# EAGLE schematic v1 (EAGLE 9.6.2)
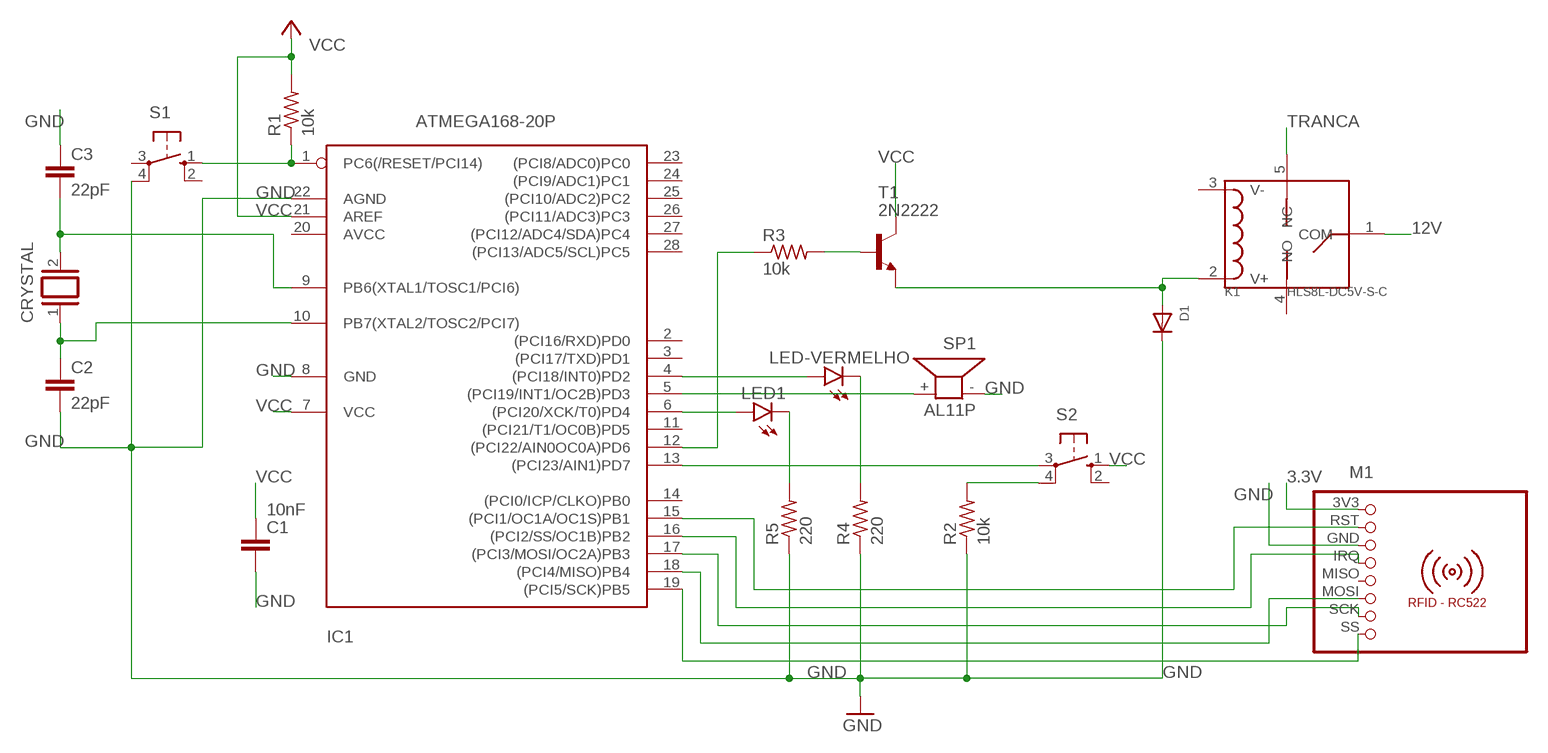
[diagram p0: schematic, sheet 1]

## Parts
C1  10nF  C-EU025-025X050  [C025-025X050]
C2  22pF  C-EU025-025X050  [C025-025X050]
C3  22pF  C-EU025-025X050  [C025-025X050]
CRYSTAL  XTAL/S  [QS]
D1  DIODEDO-1N4148  [DO-1N4148]
IC1  ATMEGA168-20P  [DIL28-3]
K1  HLS8L-DC5V-S-C  RELAY-HLS8L-DC5V-S-C(5P-19X15MM)  [REY5-19.0X15.0X15.0MM]
LED1  LED5MM  [LED5MM]
LED-VERMELHO  LED5MM  [LED5MM]
M1  RFID-RC522  [RFID-RC522]
R1  10k  R-US_0204/7  [0204/7]
R2  10k  R-US_0204/7  [0204/7]
R3  10k  R-US_0204/7  [0204/7]
R4  220  R-US_0204/7  [0204/7]
R5  220  R-US_0204/7  [0204/7]
S1  10-XX  [B3F-10XX]
S2  10-XX  [B3F-10XX]
SP1  AL11P  [AL11P]
T1  2N2222  [TO92-EBC-OVAL]

## Nets
3.3V: M1.3V3
12V: K1.1(COM)
GND: C1.2 C2.2 C3.1 D1.C IC1.8(GND) IC1.22(AGND) M1.GND R2.1 R4.1 R5.1 S1.4(P1) SP1.-
N$1: IC1.1(PC6(/RESET/PCI14)) R1.1 S1.1(S)
N$2: IC1.4((PCI18/INT0)PD2) LED-VERMELHO.A
N$3: LED-VERMELHO.K(C) R4.2
N$4: IC1.6((PCI20/XCK/T0)PD4) LED1.A
N$5: LED1.K(C) R5.2
N$6: IC1.5((PCI19/INT1/OC2B)PD3) SP1.+
N$7: IC1.13((PCI23/AIN1)PD7) S2.3(P)
N$8: R2.2 S2.4(P1)
N$9: IC1.12((PCI22/AIN0OC0A)PD6) R3.1
N$10: R3.2 T1.B
N$11: D1.A K1.2(V+) T1.E
N$12: C3.2 CRYSTAL.2 IC1.9(PB6(XTAL1/TOSC1/PCI6))
N$13: C2.1 CRYSTAL.1 IC1.10(PB7(XTAL2/TOSC2/PCI7))
N$14: IC1.15((PCI1/OC1A/OC1S)PB1) M1.RST
N$15: IC1.16((PCI2/SS/OC1B)PB2) M1.IRQ
N$16: IC1.17((PCI3/MOSI/OC2A)PB3) M1.SCK
N$17: IC1.18((PCI4/MISO)PB4) M1.MOSI
N$18: IC1.19((PCI5/SCK)PB5) M1.SS
TRANCA: K1.5(NC)
VCC: C1.1 IC1.7(VCC) IC1.21(AREF) R1.2 S2.1(S) T1.C
Unconnected: IC1.2((PCI16/RXD)PD0) IC1.3((PCI17/TXD)PD1) IC1.11((PCI21/T1/OC0B)PD5) IC1.14((PCI0/ICP/CLKO)PB0) IC1.20(AVCC) IC1.23((PCI8/ADC0)PC0) IC1.24((PCI9/ADC1)PC1) IC1.25((PCI10/ADC2)PC2) IC1.26((PCI11/ADC3)PC3) IC1.27((PCI12/ADC4/SDA)PC4) IC1.28((PCI13/ADC5/SCL)PC5) K1.3(V-) K1.4(NO) M1.MISO S1.2(S1) S1.3(P) S2.2(S1)

## Library data of the parts
C1-C3 = rcl:C-EU: CAPACITOR, European symbol; SPICEPREFIX: C
CRYSTAL = special:XTAL/S: CRYSTAL
D1 = adafruit:DIODE: Diode SMADIODE - SMA Surface Mount Package 20V 1A Schottky Diode Digikey: 641-1014-6-ND DO-1N4148 - Through Hole Small Current Diode SOD-123 20V 1 A (.5mV Vf) Schottky Diode - Digikey: MBRX120TPMSCT-ND SOD-323 10V 570mA (.38mV Vf, 3ns) Schottky Diode - Digikey: ZLLS410CT-ND SOD-523 30V 30mA Schottky Diode (RB751S-40TE61) - Digikey: RB751S-40TE61CT-ND SOT23-R/W - SOT23 Package (R = Solder Paste/Reflow Ovens, W = Hand-Soldering) BAT54Film 40V 300mA - Digikey: 497-7162-1-ND
IC1 = adafruit:ATMEGA168*P: MICROCONTROLLER 16 kBytes FLASH 1 kBytes SRAM 512 Bytes EEPROM USART 8-channel 10 bit ADC
K1 = nosso_relay:RELAY-HLS8L-DC5V-S-C(5P-19X15MM): 315030000; MPN: HLS8L-DC5V-S-C
LED1 LED-VERMELHO = led:LED: LED OSRAM: - CHIPLED LG R971, LG N971, LY N971, LG Q971, LY Q971, LO R971, LY R971 LH N974, LH R974 LS Q976, LO Q976, LY Q976 LO Q996 - Hyper CHIPLED LW Q18S LB Q993, LB Q99A, LB R99A - SideLED LS A670, LO A670, LY A670, LG A670, LP A670 LB A673, LV A673, LT A673, LW A673 LH A674 LY A675 LS A676, LA A676, LO A676, LY A676, LW A676 LS A679, LY A679, LG A679 - Hyper Micro SIDELED® LS Y876, LA Y876, LO Y876, LY Y876 LT Y87S - SmartLED LW L88C, LW L88S LB L89C, LB L89S, LG L890 LS L89K, LO L89K, LY L89K LS L896, LA L896, LO L896, LY L896 - TOPLED LS T670, LO T670, LY T670, LG T670, LP T670 LSG T670, LSP T670, LSY T670, LOP T670, LYG T670 LG T671, LOG T671, LSG T671 LB T673, LV T673, LT T673, LW T673 LH T674 LS T676, LA T676, LO T676, LY T676, LB T676, LH T676, LSB T676, LW T676 LB T67C, LV T67C, LT T67C, LS T67K, LO T67K, LY T67K, LW E67C LS E67B, LA E67B, LO E67B, LY E67B, LB E67C, LV E67C, LT E67C LW T67C LS T679, LY T679, LG T679 LS T770, LO T770, LY T770, LG T770, LP T770 LB T773, LV T773, LT T773, LW T773 LH T774 LS E675, LA E675, LY E675, LS T675 LS T776, LA T776, LO T776, LY T776, LB T776 LHGB T686 LT T68C, LB T68C - Hyper Mini TOPLED® LB M676 - Mini TOPLED Santana® LG M470 LS M47K, LO M47K, LY M47K Source: http://www.osram.convergy.de LUXEON: - LUMILED® LXK2-PW12-R00, LXK2-PW12-S00, LXK2-PW14-U00, LXK2-PW14-V00 LXK2-PM12-R00, LXK2-PM12-S00, LXK2-PM14-U00 LXK2-PE12-Q00, LXK2-PE12-R00, LXK2-PE12-S00, LXK2-PE14-T00, LXK2-PE14-U00 LXK2-PB12-K00, LXK2-PB12-L00, LXK2-PB12-M00, LXK2-PB14-N00, LXK2-PB14-P00, LXK2-PB14-Q00 LXK2-PR12-L00, LXK2-PR12-M00, LXK2-PR14-Q00, LXK2-PR14-R00 LXK2-PD12-Q00, LXK2-PD12-R00, LXK2-PD12-S00 LXK2-PH12-R00, LXK2-PH12-S00 LXK2-PL12-P00, LXK2-PL12-Q00, LXK2-PL12-R00 Source: www.luxeon.com KINGBRIGHT: KA-3528ASYC Source: www.kingbright.com
M1 = mfrc522-module:RFID-RC522: RFID-RC522 MFRC-522 based breakout board
R1-R5 = rcl:R-US_: RESISTOR, American symbol; SPICEPREFIX: R
S1 S2 = switch-omron:10-XX: OMRON SWITCH; MPN: B3F-1000; OC_FARNELL: 176432; OC_NEWARK: 36M3542
SP1 = buzzer:AL11P: SPEAKER Source: Buerklin; OC_FARNELL: unknown; OC_NEWARK: unknown
T1 = adafruit:2N2222: NPN TRANSISTOR Big oval pads